# Altium schematic sheet Panorama_V_0_0_1.SchDoc
size A3
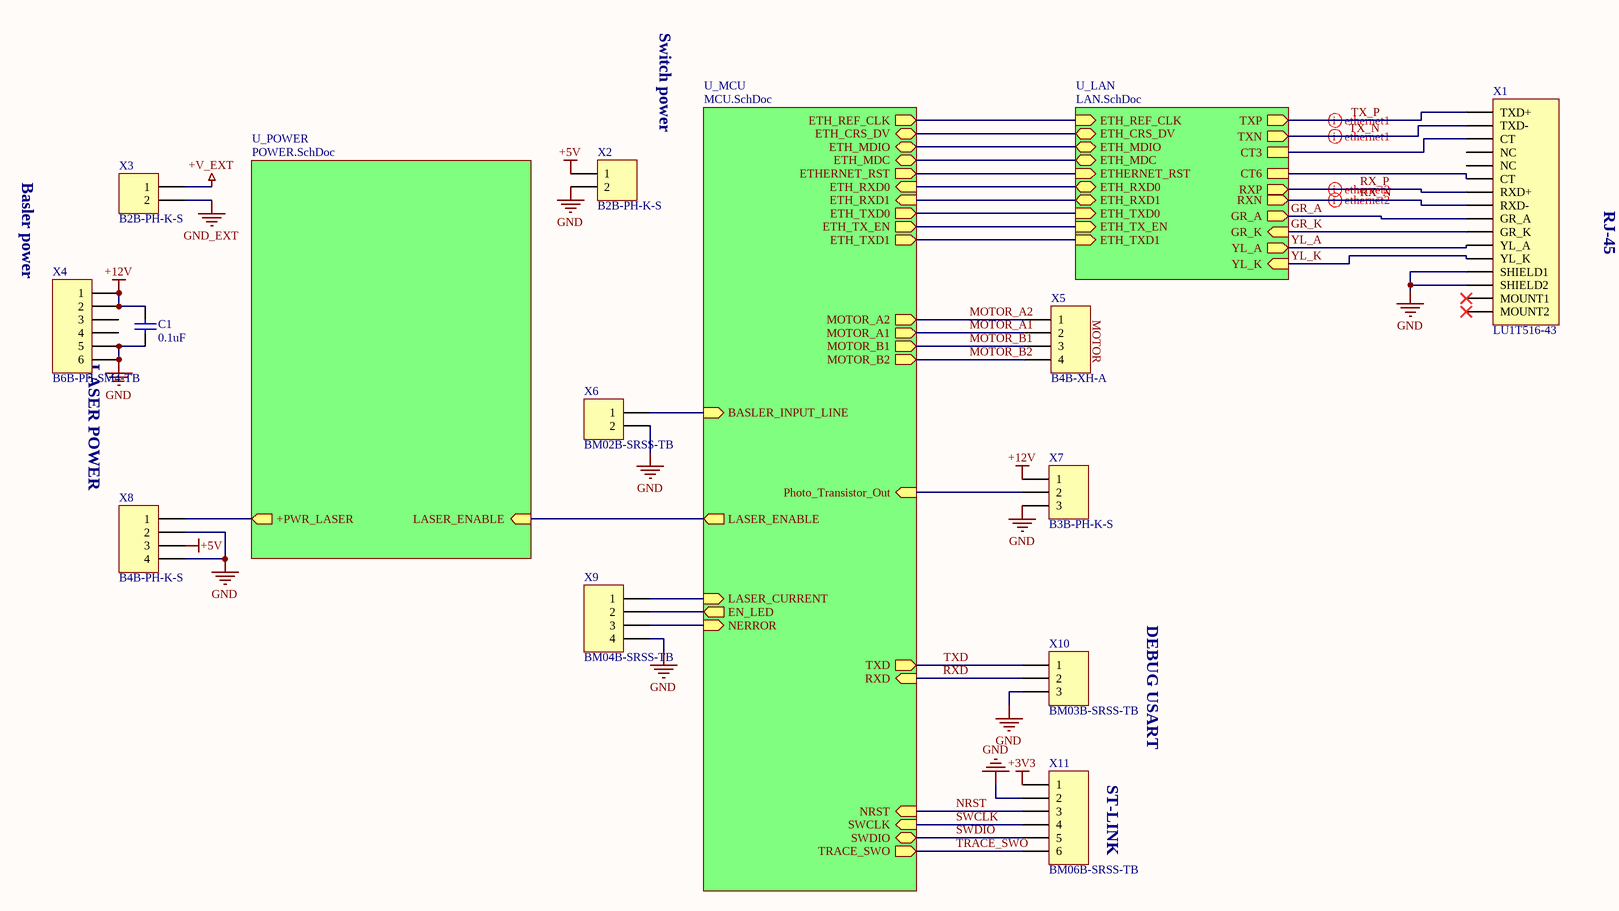
[diagram p0: Panorama_V_0_0_1.SchDoc]

## Parts
C1  value 0.1uF  [C0603]  (hidden comment: C0603-0.1uF-50V-X7R)
X1  LU1T516-43  [LU1T516-43]
X2  B2B-PH-K-S  [B2B-PH-K-S]
X3  B2B-PH-K-S  [B2B-PH-K-S]
X4  B6B-PH-SM4-TB  [B6B-PH-SM4-TB]
X5  B4B-XH-A  [B4B-XH-A]
X6  BM02B-SRSS-TB  [BM02B-SRSS-TB]
X7  B3B-PH-K-S  [B3B-PH-K-S]
X8  B4B-PH-K-S  [B4B-PH-K-S]
X9  BM04B-SRSS-TB  [BM04B-SRSS-TB]
X10  BM03B-SRSS-TB  [BM03B-SRSS-TB]
X11  BM06B-SRSS-TB  [BM06B-SRSS-TB]

## Sub-sheets
U_LAN = LAN.SchDoc: ETH_REF_CLK (in), ETH_CRS_DV (bidir), ETH_MDIO (bidir), ETH_MDC (bidir), ETHERNET_RST (in), ETH_RXD0 (bidir), ETH_RXD1 (bidir), ETH_TXD0 (in), ETH_TX_EN (in), ETH_TXD1 (in), TXP (out), TXN (out), RXP (out), RXN (out), GR_A (out), GR_K (in), YL_A (out), YL_K (in), CT3, CT6
U_MCU = MCU.SchDoc: MOTOR_A2 (out), MOTOR_A1 (out), MOTOR_B1 (out), MOTOR_B2 (out), ETH_REF_CLK (out), ETH_CRS_DV (bidir), ETH_MDIO (bidir), ETH_MDC (bidir), ETHERNET_RST (out), ETH_RXD0 (in), ETH_RXD1 (in), ETH_TXD0 (out), ETH_TX_EN (out), ETH_TXD1 (out), TXD (out), RXD (in), SWCLK (in), TRACE_SWO (out), LASER_ENABLE (out), BASLER_INPUT_LINE (in), LASER_CURRENT (in), EN_LED (out), NERROR (in), SWDIO (bidir), NRST (in), Photo_Transistor_Out (in)
U_POWER = POWER.SchDoc: LASER_ENABLE (in), +PWR_LASER (out)

## Nets
+3V3: X11.1
+5V: X2.1 X8.3
+12V: C1.2 X4.1 X4.2 X7.1
+V_EXT: X3.1
GND: C1.1 X1.13(SHIELD1) X1.14(SHIELD2) X2.2 X4.5 X4.6 X6.2 X7.3 X8.2 X8.4 X9.4 X10.3 X11.2
GND_EXT: X3.2
GR_A: X1.9(GR_A) ; sheet U_LAN/GR_A
GR_K: X1.10(GR_K) ; sheet U_LAN/GR_K
MOTOR_A1: X5.2 ; sheet U_MCU/MOTOR_A1
MOTOR_A2: X5.1 ; sheet U_MCU/MOTOR_A2
MOTOR_B1: X5.3 ; sheet U_MCU/MOTOR_B1
MOTOR_B2: X5.4 ; sheet U_MCU/MOTOR_B2
NRST: X11.3 ; sheet U_MCU/NRST
RX_N: X1.8(RXD-) ; sheet U_LAN/RXN
RX_P: X1.7(RXD+) ; sheet U_LAN/RXP
RXD: X10.2 ; sheet U_MCU/RXD
SWCLK: X11.4 ; sheet U_MCU/SWCLK
SWDIO: X11.5 ; sheet U_MCU/SWDIO
TRACE_SWO: X11.6 ; sheet U_MCU/TRACE_SWO
TX_N: X1.2(TXD-) ; sheet U_LAN/TXN
TX_P: X1.1(TXD+) ; sheet U_LAN/TXP
TXD: X10.1 ; sheet U_MCU/TXD
YL_A: X1.11(YL_A) ; sheet U_LAN/YL_A
YL_K: X1.12(YL_K) ; sheet U_LAN/YL_K
NetX1_3: X1.3(CT) ; sheet U_LAN/CT3
NetX1_6: X1.6(CT) ; sheet U_LAN/CT6
NetX6_1: X6.1 ; sheet U_MCU/BASLER_INPUT_LINE
NetX7_2: X7.2 ; sheet U_MCU/Photo_Transistor_Out
NetX8_1: X8.1 ; sheet U_POWER/+PWR_LASER
NetX9_1: X9.1 ; sheet U_MCU/LASER_CURRENT
NetX9_2: X9.2 ; sheet U_MCU/EN_LED
NetX9_3: X9.3 ; sheet U_MCU/NERROR
(unnamed): sheet U_POWER/LASER_ENABLE, sheet U_MCU/LASER_ENABLE
(unnamed): sheet U_MCU/ETH_REF_CLK, sheet U_LAN/ETH_REF_CLK
(unnamed): sheet U_MCU/ETH_CRS_DV, sheet U_LAN/ETH_CRS_DV
(unnamed): sheet U_MCU/ETH_MDIO, sheet U_LAN/ETH_MDIO
(unnamed): sheet U_MCU/ETH_MDC, sheet U_LAN/ETH_MDC
(unnamed): sheet U_MCU/ETHERNET_RST, sheet U_LAN/ETHERNET_RST
(unnamed): sheet U_MCU/ETH_RXD0, sheet U_LAN/ETH_RXD0
(unnamed): sheet U_MCU/ETH_RXD1, sheet U_LAN/ETH_RXD1
(unnamed): sheet U_MCU/ETH_TXD0, sheet U_LAN/ETH_TXD0
(unnamed): sheet U_MCU/ETH_TX_EN, sheet U_LAN/ETH_TX_EN
(unnamed): sheet U_MCU/ETH_TXD1, sheet U_LAN/ETH_TXD1

Not connected (* = marked no-connect by the designer): X1 4(NC) 5(NC) 15(MOUNT1)* 16(MOUNT2)*; X4 3 4 7(DNC) 8(DNC); X6 3(DNC) 4(DNC); X9 5 6; X10 4(DNC) 5(DNC); X11 7(DNC) 8(DNC)

## Layout directives
differential pair: RX_N, RX_P, TX_N, TX_P

## Notes on the sheet
- Switch power
- RJ-45
- (near X4) Basler power
- (near X5) MOTOR
- (near X8) LASER POWER
- DEBUG USART
- (near X11) ST-LINK

## Library data of the parts
C1 = C0603-0.1uF-50V-X7R: Ceramic Capacitor; Supplier 1: Digi-Key; Supplier Part Number 1: 445-1324-1-ND
X1 = LU1T516-43: Ethernet RJ-45
X2 X3 = B2B-PH-K-S: Connector, 2mm; Voltage: 100V; Current: 2A; HelpUrl: \\Storage\Volume_2\SPEKTR-AT\Catalogs\Jst\PH.pdf; Supplier 1: Digi-Key; Supplier Part Number 1: 455-1262-ND
X4 = B6B-PH-SM4-TB: Connector, 2mm; Voltage: 100V; Current: 2A; HelpUrl: \\Storage\Volume_2\SPEKTR-AT\Catalogs\Jst\PH.pdf; Supplier 1: Digi-Key; Supplier Part Number 1: 455-1738-1-ND
X5 = B4B-XH-A: Connector, 2.5mm; Voltage: 250V; Current: 3A; HelpUrl: \\Storage\Volume_2\SPEKTR-AT\Catalogs\Jst\eXH.pdf; Supplier 1: Digi-Key; Supplier Part Number 1: 455-2249-ND
X6 = BM02B-SRSS-TB: Connector, 1mm; Voltage: 50V; Current: 0.7A; HelpUrl: \\Storage\Volume_2\SPEKTR-AT\Catalogs\Jst\eSR.pdf; Supplier 1: Digi-Key; Supplier Part Number 1: 455-1406-1-ND
X7 = B3B-PH-K-S: Connector, 2mm; Voltage: 100V; Current: 2A; HelpUrl: \\Storage\Volume_2\SPEKTR-AT\Catalogs\Jst\PH.pdf; Supplier 1: Digi-Key; Supplier Part Number 1: 455-1273-ND
X8 = B4B-PH-K-S: Connector, 2mm; Voltage: 100V; Current: 2A; HelpUrl: \\Storage\Volume_2\SPEKTR-AT\Catalogs\Jst\PH.pdf; Supplier 1: Digi-Key; Supplier Part Number 1: 455-1279-ND
X9 = BM04B-SRSS-TB: Connector, 1mm; Voltage: 50V; Current: 0.7A; HelpUrl: \\Storage\Volume_2\SPEKTR-AT\Catalogs\Jst\eSR.pdf; Supplier 1: Digi-Key; Supplier Part Number 1: 455-1408-1-ND
X10 = BM03B-SRSS-TB: Connector, 1mm; Voltage: 50V; Current: 0.7A; HelpUrl: \\Storage\Volume_2\SPEKTR-AT\Catalogs\Jst\eSR.pdf; Supplier 1: Digi-Key; Supplier Part Number 1: 455-1407-1-ND
X11 = BM06B-SRSS-TB: Connector, 1mm; Voltage: 50V; Current: 0.7A; HelpUrl: \\Storage\Volume_2\SPEKTR-AT\Catalogs\Jst\eSR.pdf; Supplier 1: Digi-Key; Supplier Part Number 1: 455-1410-1-ND